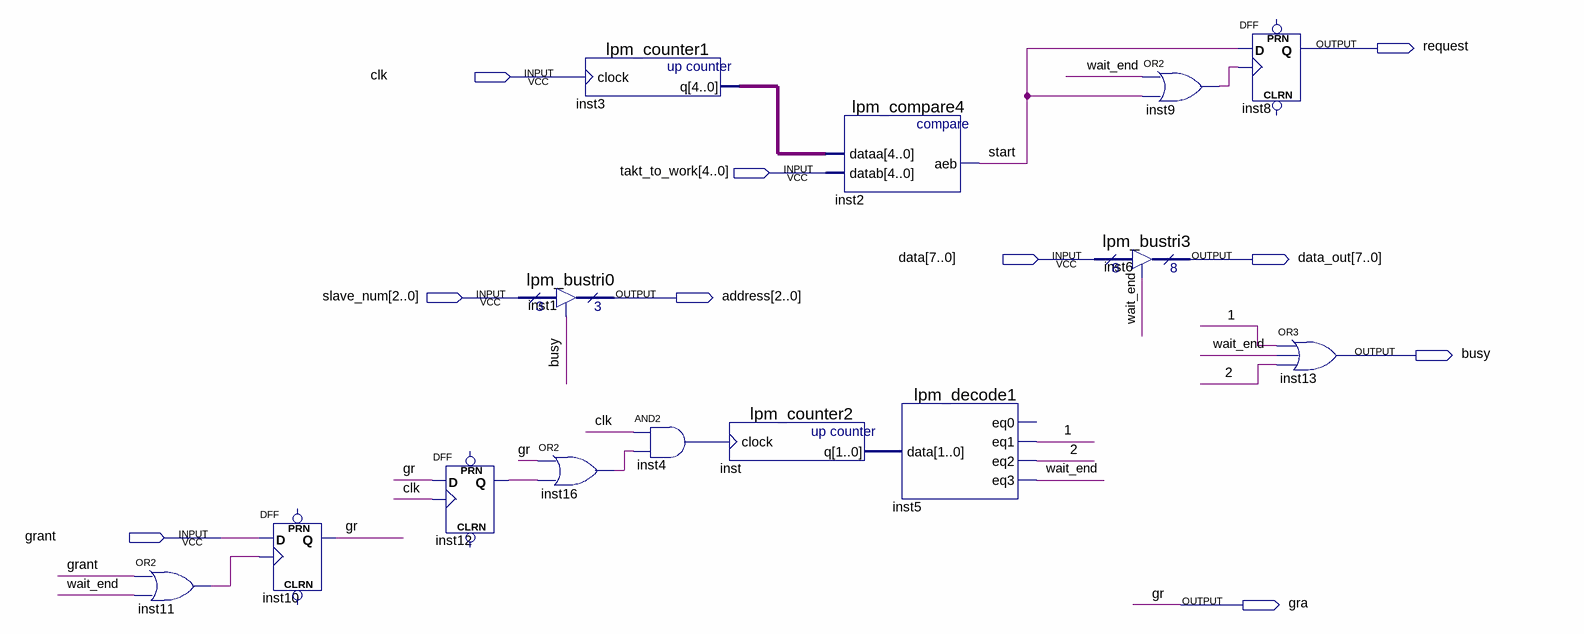
[diagram p0: schematic sheet]
// Quartus schematic master.bdf as structural Verilog: 14 symbols, 10 pins
module master (
  input  clk,
  input  [4:0] takt_to_work,
  input  [7:0] data,
  input  [2:0] slave_num,
  input  grant,
  output request,
  output [7:0] data_out,
  output [2:0] address,
  output busy,
  output gra
);

  wire \1 , \2 , inst4_out, inst9_out, inst11_out, inst12_q, inst16_out, start, wait_end;
  wire [1:0] inst_q;
  wire [4:0] inst3_q;

  or inst11 (inst11_out, grant, wait_end);
  DFF inst10 (.CLK(inst11_out), .D(grant), .Q(gra));  // open: CLRN, PRN
  DFF inst12 (.CLK(clk), .D(gra), .Q(inst12_q));  // open: CLRN, PRN
  lpm_counter1 inst3 (.clock(clk), .q(inst3_q));
  lpm_bustri0 inst1 (.enabledt(busy), .data(slave_num), .tridata(address));
  or inst16 (inst16_out, gra, inst12_q);
  and inst4 (inst4_out, clk, inst16_out);
  lpm_counter2 inst (.clock(inst4_out), .q(inst_q));
  lpm_compare4 inst2 (.dataa(inst3_q), .datab(takt_to_work), .aeb(start));
  lpm_decode1 inst5 (.data(inst_q), .eq1(\1 ), .eq2(\2 ), .eq3(wait_end));  // open: eq0
  lpm_bustri3 inst6 (.enabledt(wait_end), .data(data), .tridata(data_out));
  or inst9 (inst9_out, wait_end, start);
  DFF inst8 (.CLK(inst9_out), .D(start), .Q(request));  // open: CLRN, PRN
  or inst13 (busy, \1 , wait_end, \2 );

  // Other names for the same wires on the sheet: gr = gra
endmodule
